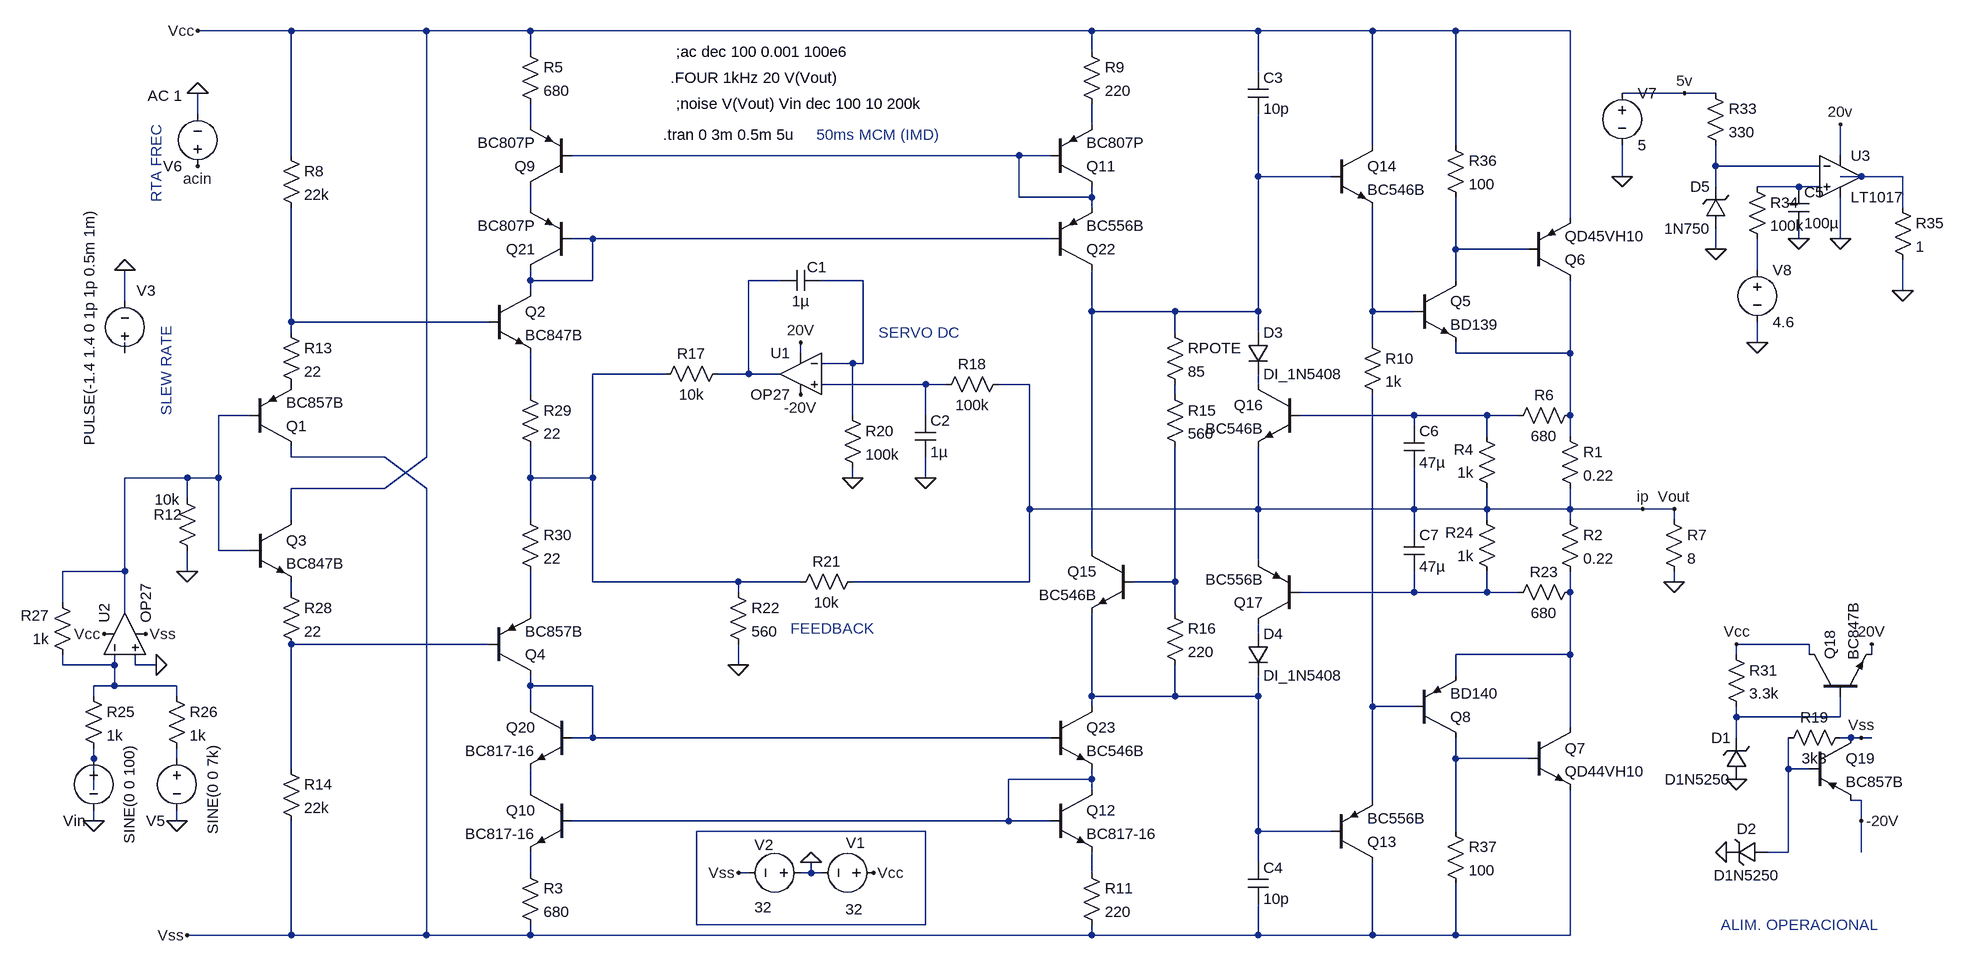
[diagram p0: schematic sim.asc]
sim.asc, the LTspice schematic file:
Version 4
SHEET 1 2788 1284
WIRE -16 -448 -160 -448
WIRE 192 -448 -16 -448
WIRE 352 -448 192 -448
WIRE 1216 -448 352 -448
WIRE 1472 -448 1216 -448
WIRE 1648 -448 1472 -448
WIRE 1776 -448 1648 -448
WIRE 1952 -448 1776 -448
WIRE 352 -416 352 -448
WIRE 1216 -416 1216 -448
WIRE 1472 -384 1472 -448
WIRE 2128 -352 2032 -352
WIRE 2176 -352 2128 -352
WIRE -160 -320 -160 -352
WIRE 352 -304 352 -336
WIRE 1216 -304 1216 -336
WIRE 1648 -272 1648 -448
WIRE 1776 -272 1776 -448
WIRE -16 -256 -16 -448
WIRE 1104 -256 416 -256
WIRE 1152 -256 1104 -256
WIRE 2368 -256 2368 -304
WIRE 2176 -240 2176 -272
WIRE 2336 -240 2176 -240
WIRE 1472 -224 1472 -320
WIRE 1584 -224 1472 -224
WIRE 2032 -224 2032 -272
WIRE 2400 -224 2368 -224
WIRE 2464 -224 2400 -224
WIRE 2176 -208 2176 -240
WIRE 2304 -208 2240 -208
WIRE 2336 -208 2304 -208
WIRE 1104 -192 1104 -256
WIRE 1216 -192 1216 -208
WIRE 1216 -192 1104 -192
WIRE 352 -176 352 -208
WIRE 1216 -176 1216 -192
WIRE 2464 -176 2464 -224
WIRE 1952 -160 1952 -448
WIRE 448 -128 416 -128
WIRE 1152 -128 448 -128
WIRE 2304 -128 2304 -144
WIRE 2368 -128 2368 -192
WIRE 1776 -112 1776 -192
WIRE 1888 -112 1776 -112
WIRE 2176 -112 2176 -144
WIRE 2240 -80 2240 -128
WIRE 352 -64 352 -80
WIRE 448 -64 448 -128
WIRE 448 -64 352 -64
WIRE 736 -64 688 -64
WIRE 864 -64 800 -64
WIRE 1776 -64 1776 -112
WIRE 352 -48 352 -64
WIRE 2464 -48 2464 -96
WIRE -272 -32 -272 -80
WIRE 1216 -16 1216 -80
WIRE 1344 -16 1216 -16
WIRE 1472 -16 1472 -224
WIRE 1472 -16 1344 -16
WIRE 1648 -16 1648 -176
WIRE 1712 -16 1648 -16
WIRE -16 0 -16 -176
WIRE 288 0 -16 0
WIRE -16 16 -16 0
WIRE 1344 16 1344 -16
WIRE 1472 16 1472 -16
WIRE 1648 32 1648 -16
WIRE 2240 32 2240 0
WIRE -272 48 -272 32
WIRE 768 48 768 32
WIRE 1776 48 1776 32
WIRE 1952 48 1952 -64
WIRE 1952 48 1776 48
WIRE 848 64 800 64
WIRE 864 64 864 -64
WIRE 864 64 848 64
WIRE 560 80 448 80
WIRE 688 80 688 -64
WIRE 688 80 640 80
WIRE 736 80 688 80
WIRE 960 96 800 96
WIRE 992 96 960 96
WIRE 1120 96 1072 96
WIRE 1472 96 1472 80
WIRE 352 112 352 48
WIRE 1344 112 1344 96
WIRE -80 144 -128 144
WIRE 848 144 848 64
WIRE 960 144 960 96
WIRE 1712 144 1536 144
WIRE 1824 144 1712 144
WIRE 1872 144 1824 144
WIRE 1952 144 1952 48
WIRE 1712 160 1712 144
WIRE 1824 176 1824 144
WIRE 1952 176 1952 144
WIRE -16 208 -16 192
WIRE 128 208 -16 208
WIRE 192 208 192 -448
WIRE -176 240 -272 240
WIRE -128 240 -128 144
WIRE -128 240 -176 240
WIRE 352 240 352 192
WIRE 448 240 448 80
WIRE 448 240 352 240
WIRE 848 240 848 224
WIRE 960 240 960 208
WIRE 128 256 192 208
WIRE 128 256 -16 256
WIRE 192 256 128 208
WIRE -176 272 -176 240
WIRE 1120 288 1120 96
WIRE 1472 288 1472 192
WIRE 1472 288 1120 288
WIRE 1712 288 1712 224
WIRE 1712 288 1472 288
WIRE 1824 288 1824 256
WIRE 1824 288 1712 288
WIRE 1952 288 1952 256
WIRE 1952 288 1824 288
WIRE 2064 288 1952 288
WIRE 2112 288 2064 288
WIRE -16 304 -16 256
WIRE 352 304 352 240
WIRE 1824 304 1824 288
WIRE 1952 304 1952 288
WIRE 2112 304 2112 288
WIRE 1712 320 1712 288
WIRE -128 352 -128 240
WIRE -80 352 -128 352
WIRE 1216 352 1216 -16
WIRE 1472 368 1472 288
WIRE -272 384 -272 240
WIRE -272 384 -368 384
WIRE -176 384 -176 352
WIRE 448 400 448 240
WIRE 672 400 448 400
WIRE 768 400 672 400
WIRE 1120 400 1120 288
WIRE 1120 400 848 400
WIRE 1344 400 1344 192
WIRE 1344 400 1280 400
WIRE 2112 400 2112 384
WIRE -16 416 -16 400
WIRE 672 416 672 400
WIRE 1712 416 1712 384
WIRE 1712 416 1536 416
WIRE 1824 416 1824 384
WIRE 1824 416 1712 416
WIRE 1872 416 1824 416
WIRE 1952 416 1952 384
WIRE -368 432 -368 384
WIRE -272 448 -272 384
WIRE 352 448 352 384
WIRE 1344 448 1344 400
WIRE 1472 480 1472 464
WIRE 288 496 -16 496
WIRE 2320 496 2208 496
WIRE 1952 512 1952 416
WIRE 1952 512 1776 512
WIRE 2208 512 2208 496
WIRE 2320 512 2320 496
WIRE 2416 512 2416 496
WIRE -368 528 -368 512
WIRE -288 528 -288 512
WIRE -288 528 -368 528
WIRE -256 528 -256 512
WIRE -224 528 -256 528
WIRE 672 528 672 496
WIRE 1776 544 1776 512
WIRE -288 560 -288 528
WIRE -288 560 -320 560
WIRE -192 560 -288 560
WIRE 352 560 352 544
WIRE 448 560 352 560
WIRE -320 576 -320 560
WIRE -192 576 -192 560
WIRE 1216 576 1216 448
WIRE 1344 576 1344 528
WIRE 1344 576 1216 576
WIRE 1472 576 1472 544
WIRE 1472 576 1344 576
WIRE 352 592 352 560
WIRE 1216 592 1216 576
WIRE 1648 592 1648 112
WIRE 1712 592 1648 592
WIRE 2208 608 2208 592
WIRE 2368 608 2368 576
WIRE 2368 608 2208 608
WIRE 1952 624 1952 512
WIRE 448 640 448 560
WIRE 448 640 416 640
WIRE 1152 640 448 640
WIRE 2208 640 2208 608
WIRE 2384 640 2368 640
WIRE 2400 640 2384 640
WIRE 2416 640 2400 640
WIRE -320 672 -320 656
WIRE -192 672 -192 656
WIRE 1776 672 1776 640
WIRE 1888 672 1776 672
WIRE -16 688 -16 496
WIRE 2288 688 2288 640
WIRE 2320 688 2288 688
WIRE 1216 704 1216 688
WIRE 1216 704 1088 704
WIRE -320 720 -320 672
WIRE 352 720 352 688
WIRE 1216 720 1216 704
WIRE 1648 736 1648 592
WIRE 2400 736 2384 736
WIRE -320 768 -320 752
WIRE -192 768 -192 752
WIRE 1088 768 1088 704
WIRE 1088 768 416 768
WIRE 1152 768 1088 768
WIRE 2400 768 2400 736
WIRE 960 784 608 784
WIRE 1472 784 1472 576
WIRE 1584 784 1472 784
WIRE 1776 784 1776 672
WIRE 2288 816 2288 688
WIRE 2288 816 2256 816
WIRE 2400 816 2400 768
WIRE 1472 832 1472 784
WIRE 352 848 352 816
WIRE 688 848 672 848
WIRE 784 848 784 832
WIRE 784 848 768 848
WIRE 800 848 784 848
WIRE 1216 848 1216 816
WIRE 608 928 608 784
WIRE 960 928 960 784
WIRE 960 928 608 928
WIRE -16 944 -16 768
WIRE -16 944 -176 944
WIRE 192 944 192 256
WIRE 192 944 -16 944
WIRE 352 944 352 928
WIRE 352 944 192 944
WIRE 1216 944 1216 928
WIRE 1216 944 352 944
WIRE 1472 944 1472 896
WIRE 1472 944 1216 944
WIRE 1648 944 1648 832
WIRE 1648 944 1472 944
WIRE 1776 944 1776 864
WIRE 1776 944 1648 944
WIRE 1952 944 1952 720
WIRE 1952 944 1776 944
FLAG 784 832 0
FLAG 880 848 Vcc
FLAG 672 848 Vss
FLAG -272 -80 0
FLAG -176 384 0
FLAG 848 240 0
FLAG 672 528 0
FLAG -160 -448 Vcc
FLAG -176 944 Vss
FLAG 2112 400 0
FLAG 2112 288 Vout
FLAG 2064 288 ip
FLAG -224 528 0
FLAG -320 768 0
FLAG -192 768 0
FLAG -304 480 Vcc
FLAG -240 480 Vss
FLAG -160 -352 0
FLAG 2208 704 0
FLAG 2208 496 Vcc
FLAG 2416 496 20V
FLAG 2192 816 0
FLAG 768 112 -20V
FLAG 768 32 20V
FLAG 960 240 0
FLAG 2176 -112 0
FLAG 2032 -224 0
FLAG 2128 -352 5v
FLAG 2368 -304 20v
FLAG 2368 -128 0
FLAG 2304 -128 0
FLAG 2464 -48 0
FLAG 2240 32 0
FLAG -160 -240 acin
FLAG 2400 768 -20V
FLAG 2400 640 Vss
SYMBOL res 336 832 R0
SYMATTR InstName R3
SYMATTR Value 680
SYMBOL res 336 -432 R0
SYMATTR InstName R5
SYMATTR Value 680
SYMBOL voltage 896 848 R90
WINDOW 123 0 0 Left 2
WINDOW 39 0 0 Left 2
WINDOW 0 -46 29 VRight 2
WINDOW 3 56 32 VRight 2
SYMATTR InstName V1
SYMATTR Value 32
SYMBOL voltage 784 848 R90
WINDOW 123 0 0 Left 2
WINDOW 39 0 0 Left 2
WINDOW 0 -43 58 VRight 2
WINDOW 3 53 60 VRight 2
SYMATTR InstName V2
SYMATTR Value 32
SYMBOL voltage -272 64 R180
WINDOW 3 55 -127 VRight 2
WINDOW 123 0 0 Left 2
WINDOW 39 0 0 Left 2
WINDOW 0 -47 112 Left 2
SYMATTR Value PULSE(-1.4 1.4 0 1p 1p 0.5m 1m)
SYMATTR InstName V3
SYMBOL pnp 416 -208 R180
SYMATTR InstName Q9
SYMATTR Value BC807P
SYMBOL npn 416 720 M0
SYMATTR InstName Q10
SYMATTR Value BC817-16
SYMBOL pnp 1152 -208 M180
SYMATTR InstName Q11
SYMATTR Value BC807P
SYMBOL npn 1152 720 R0
SYMATTR InstName Q12
SYMATTR Value BC817-16
SYMBOL res 1200 -432 R0
SYMATTR InstName R9
SYMATTR Value 220
SYMBOL res 1200 832 R0
SYMATTR InstName R11
SYMATTR Value 220
SYMBOL res -192 256 R0
WINDOW 0 -36 40 Left 2
WINDOW 3 -34 17 Left 2
SYMATTR InstName R12
SYMATTR Value 10k
SYMBOL cap 800 -80 R90
WINDOW 0 11 7 VBottom 2
WINDOW 3 32 32 VTop 2
SYMATTR InstName C1
SYMATTR Value 1µ
SYMBOL res 656 64 R90
WINDOW 0 0 56 VBottom 2
WINDOW 3 32 56 VTop 2
SYMATTR InstName R17
SYMATTR Value 10k
SYMBOL res 832 128 R0
SYMATTR InstName R20
SYMATTR Value 100k
SYMBOL res 864 384 R90
WINDOW 0 0 56 VBottom 2
WINDOW 3 32 56 VTop 2
SYMATTR InstName R21
SYMATTR Value 10k
SYMBOL res 656 400 R0
SYMATTR InstName R22
SYMATTR Value 560
SYMBOL pnp 1888 -64 M180
SYMATTR InstName Q6
SYMATTR Value QD45VH10
SYMBOL res 1936 160 R0
SYMATTR InstName R1
SYMATTR Value 0.22
SYMBOL res 1936 288 R0
SYMATTR InstName R2
SYMATTR Value 0.22
SYMBOL res 2096 288 R0
SYMATTR InstName R7
SYMATTR Value 8
SYMBOL npn 1888 624 R0
SYMATTR InstName Q7
SYMATTR Value QD44VH10
SYMBOL res -32 -272 R0
SYMATTR InstName R8
SYMATTR Value 22k
SYMBOL res -32 672 R0
SYMATTR InstName R14
SYMATTR Value 22k
SYMBOL pnp 1152 -80 M180
SYMATTR InstName Q22
SYMATTR Value BC556B
SYMBOL npn 1152 592 R0
SYMATTR InstName Q23
SYMATTR Value BC546B
SYMBOL pnp -80 192 M180
SYMATTR InstName Q1
SYMATTR Value BC857B
SYMBOL npn 288 -48 R0
SYMATTR InstName Q2
SYMATTR Value BC847B
SYMBOL npn -80 304 R0
SYMATTR InstName Q3
SYMATTR Value BC847B
SYMBOL pnp 288 544 M180
SYMATTR InstName Q4
SYMATTR Value BC857B
SYMBOL res 1328 96 R0
SYMATTR InstName R15
SYMATTR Value 560
SYMBOL res 1328 432 R0
SYMATTR InstName R16
SYMATTR Value 220
SYMBOL Opamps\\OP27 768 16 M0
SYMATTR InstName U1
SYMBOL Opamps\\OP27 -336 480 R270
SYMATTR InstName U2
SYMBOL res -336 560 R0
SYMATTR InstName R25
SYMATTR Value 1k
SYMBOL res -208 560 R0
SYMATTR InstName R26
SYMATTR Value 1k
SYMBOL res -352 528 R180
WINDOW 0 36 76 Left 2
WINDOW 3 36 40 Left 2
SYMATTR InstName R27
SYMATTR Value 1k
SYMBOL voltage -320 656 R0
WINDOW 3 55 -5 VRight 2
WINDOW 123 0 0 Left 2
WINDOW 39 0 0 Left 2
WINDOW 0 -47 112 Left 2
SYMATTR Value SINE(0 0 100)
SYMATTR InstName Vin
SYMBOL voltage -192 656 R0
WINDOW 3 55 -5 VRight 2
WINDOW 123 0 0 Left 2
WINDOW 39 0 0 Left 2
WINDOW 0 -47 112 Left 2
SYMATTR Value SINE(0 0 7k)
SYMATTR InstName V5
SYMBOL cap 1456 -384 R0
SYMATTR InstName C3
SYMATTR Value 10p
SYMBOL cap 1456 832 R0
SYMATTR InstName C4
SYMATTR Value 10p
SYMBOL pnp 1584 832 M180
SYMATTR InstName Q13
SYMATTR Value BC556B
SYMBOL npn 1584 -272 R0
SYMATTR InstName Q14
SYMATTR Value BC546B
SYMBOL npn 1280 352 M0
SYMATTR InstName Q15
SYMATTR Value BC546B
SYMBOL res 1328 0 R0
SYMATTR InstName RPOTE
SYMATTR Value 85
SYMBOL res 1840 272 R180
WINDOW 0 36 76 Left 2
WINDOW 3 36 40 Left 2
SYMATTR InstName R4
SYMATTR Value 1k
SYMBOL res 1968 128 R90
WINDOW 0 0 56 VBottom 2
WINDOW 3 32 56 VTop 2
SYMATTR InstName R6
SYMATTR Value 680
SYMBOL res 1968 400 R90
WINDOW 0 0 56 VBottom 2
WINDOW 3 32 56 VTop 2
SYMATTR InstName R23
SYMATTR Value 680
SYMBOL res 1840 400 R180
WINDOW 0 36 76 Left 2
WINDOW 3 36 40 Left 2
SYMATTR InstName R24
SYMATTR Value 1k
SYMBOL res -32 0 R0
SYMATTR InstName R13
SYMATTR Value 22
SYMBOL res -32 400 R0
SYMATTR InstName R28
SYMATTR Value 22
SYMBOL res 336 96 R0
SYMATTR InstName R29
SYMATTR Value 22
SYMBOL res 336 288 R0
SYMATTR InstName R30
SYMATTR Value 22
SYMBOL voltage -160 -224 R180
WINDOW 123 24 124 Left 2
WINDOW 39 0 0 Left 2
SYMATTR Value2 AC 1
SYMATTR InstName V6
SYMATTR Value ""
SYMBOL zener 2224 704 R180
WINDOW 0 24 64 Left 2
WINDOW 3 24 0 Left 2
SYMATTR InstName D1
SYMATTR Value D1N5250
SYMBOL res 2192 496 R0
SYMATTR InstName R31
SYMATTR Value 3.3k
SYMBOL npn 2320 576 R270
SYMATTR InstName Q18
SYMATTR Value BC847B
SYMBOL zener 2256 800 R90
WINDOW 0 -4 32 VBottom 2
WINDOW 3 36 32 VTop 2
SYMATTR InstName D2
SYMATTR Value D1N5250
SYMBOL pnp 2320 640 R0
SYMATTR InstName Q19
SYMATTR Value BC857B
SYMBOL cap 944 144 R0
SYMATTR InstName C2
SYMATTR Value 1µ
SYMBOL res 1088 80 R90
WINDOW 0 0 56 VBottom 2
WINDOW 3 32 56 VTop 2
SYMATTR InstName R18
SYMATTR Value 100k
SYMBOL zener 2192 -144 R180
WINDOW 0 24 64 Left 2
WINDOW 3 24 0 Left 2
SYMATTR InstName D5
SYMATTR Value 1N750
SYMATTR Description Diode
SYMATTR Type diode
SYMBOL res 2160 -368 R0
SYMATTR InstName R33
SYMATTR Value 330
SYMBOL Comparators\\LT1017 2368 -224 R0
SYMATTR InstName U3
SYMBOL voltage 2032 -368 R0
SYMATTR InstName V7
SYMATTR Value 5
SYMBOL cap 2288 -208 R0
SYMATTR InstName C5
SYMATTR Value 100µ
SYMBOL res 2224 -224 R0
SYMATTR InstName R34
SYMATTR Value 100k
SYMBOL res 2448 -192 R0
SYMATTR InstName R35
SYMATTR Value 1
SYMBOL voltage 2240 -96 R0
SYMATTR InstName V8
SYMATTR Value 4.6
SYMBOL res 1632 16 R0
SYMATTR InstName R10
SYMATTR Value 1k
SYMBOL npn 416 592 M0
SYMATTR InstName Q20
SYMATTR Value BC817-16
SYMBOL pnp 416 -80 R180
SYMATTR InstName Q21
SYMATTR Value BC807P
SYMBOL npn 1712 -64 R0
SYMATTR InstName Q5
SYMATTR Value BD139
SYMBOL pnp 1712 640 M180
SYMATTR InstName Q8
SYMATTR Value BD140
SYMBOL diode 1456 16 R0
SYMATTR InstName D3
SYMATTR Value DI_1N5408
SYMBOL diode 1456 480 R0
SYMATTR InstName D4
SYMATTR Value DI_1N5408
SYMBOL npn 1536 96 M0
SYMATTR InstName Q16
SYMATTR Value BC546B
SYMBOL pnp 1536 464 R180
SYMATTR InstName Q17
SYMATTR Value BC556B
SYMBOL cap 1696 160 R0
SYMATTR InstName C6
SYMATTR Value 47µ
SYMBOL cap 1696 320 R0
SYMATTR InstName C7
SYMATTR Value 47µ
SYMBOL res 1760 -288 R0
SYMATTR InstName R36
SYMATTR Value 100
SYMBOL res 1760 768 R0
SYMATTR InstName R37
SYMATTR Value 100
SYMBOL res 2384 624 R90
WINDOW 0 0 56 VBottom 2
WINDOW 3 32 56 VTop 2
SYMATTR InstName R19
SYMATTR Value 3k3
TEXT 760 -288 Right 2 !.tran 0 3m 0.5m 5u
TEXT 888 16 Left 2 ;SERVO DC
TEXT 752 472 Left 2 ;FEEDBACK
TEXT -208 144 VLeft 2 ;SLEW RATE
TEXT 568 -376 Left 2 !.FOUR 1kHz 20 V(Vout)
TEXT 576 -336 Left 2 !;noise V(Vout) Vin dec 100 10 200k
TEXT 576 -416 Left 2 !;ac dec 100 0.001 100e6
TEXT -224 -304 VRight 2 ;RTA FREC
TEXT 2184 928 Left 2 ;ALIM. OPERACIONAL
TEXT 792 -288 Left 2 ;50ms MCM (IMD)

The netlist it stands for:
* sim.asc
R3 N044 Vss 680
R5 Vcc N001 680
V1 Vcc 0 32
V2 0 Vss 32
V3 N016 0 PULSE(-1.4 1.4 0 1p 1p 0.5m 1m)
Q9 N008 N003 N001 0 BC807P
Q10 N042 N041 N044 0 BC817-16
Q11 N003 N003 N002 0 BC807P
Q12 N041 N041 N045 0 BC817-16
R9 Vcc N002 220
R11 N045 Vss 220
R12 N023 0 10k
C1 N013 N012 1µ
R17 N012 N018 10k
R20 N013 0 100k
R21 ip N018 10k
R22 N018 0 560
Q6 N017 N010 Vcc 0 QD45VH10
R1 N017 ip 0.22
R2 ip N028 0.22
R7 ip 0 8
Q7 N028 N039 Vss 0 QD44VH10
R8 Vcc N015 22k
R14 N031 Vss 22k
Q22 N005 N009 N003 0 BC556B
Q23 N034 N033 N041 0 BC546B
Q1 Vss N023 P001 0 BC857B
Q2 N009 N015 N021 0 BC847B
Q3 Vcc N023 N026 0 BC847B
Q4 N033 N031 N029 0 BC857B
R15 N022 N025 560
R16 N025 N034 220
XU1 N019 N013 20V -20V N012 OP27  ; pins In+ In- V+ V- OUT
XU2 0 N032 Vcc Vss N023 OP27  ; pins In+ In- V+ V- OUT
R25 N032 N037 1k
R26 N032 N038 1k
R27 N032 N023 1k
Vin N037 0 SINE(0 0 100)
V5 N038 0 SINE(0 0 7k)
C3 Vcc N005 10p
C4 N034 Vss 10p
Q13 Vss N034 N035 0 BC556B
Q14 Vcc N005 N014 0 BC546B
Q15 N005 N025 N034 0 BC546B
RPOTE N005 N022 85
R4 ip N024 1k
R6 N017 N024 680
R23 N028 N027 680
R24 N027 ip 1k
R13 N015 P001 22
R28 N026 N031 22
R29 N021 N018 22
R30 N018 N029 22
V6 acin 0 AC 1
D1 0 N036 D1N5250
R31 Vcc N036 3.3k
Q18 Vcc N036 20V 0 BC847B
D2 N040 0 D1N5250
Q19 Vss N040 -20V 0 BC857B
C2 N019 0 1µ
R18 ip N019 100k
D5 0 N004 1N750
R33 5v N004 330
XU3 N007 N004 20V 0 N006 LT1017  ; pins In+ In- V+ V- OUT
V7 5v 0 5
C5 N007 0 100µ
R34 N007 N011 100k
R35 N006 0 1
V8 N011 0 4.6
R10 N014 N035 1k
Q20 N033 N033 N042 0 BC817-16
Q21 N009 N009 N008 0 BC807P
Q5 N010 N014 N017 0 BD139
Q8 N039 N035 N028 0 BD140
D3 N005 N020 DI_1N5408
D4 N030 N034 DI_1N5408
Q16 N020 N024 ip 0 BC546B
Q17 N030 N027 ip 0 BC556B
C6 N024 ip 47µ
C7 ip N027 47µ
R36 Vcc N010 100
R37 N039 Vss 100
R19 Vss N040 3k3
.model D D
.lib standard.dio
.model NPN NPN
.model PNP PNP
.lib standard.bjt
.tran 0 3m 0.5m 5u
* SERVO DC
* FEEDBACK
* SLEW RATE
.FOUR 1kHz 20 V(Vout)
;noise V(Vout) Vin dec 100 10 200k
;ac dec 100 0.001 100e6
* RTA FREC
* ALIM. OPERACIONAL
* 50ms MCM (IMD)
.lib ADI.lib
.backanno
.end